# EasyEDA schematic SCH_LIGA2026_2026-04-17.json
TITLE: LIGA2026; REV: 1.0; Date: 2026-03-22; Sheet: 1/1; Drawn By: AIX; Company: AIX
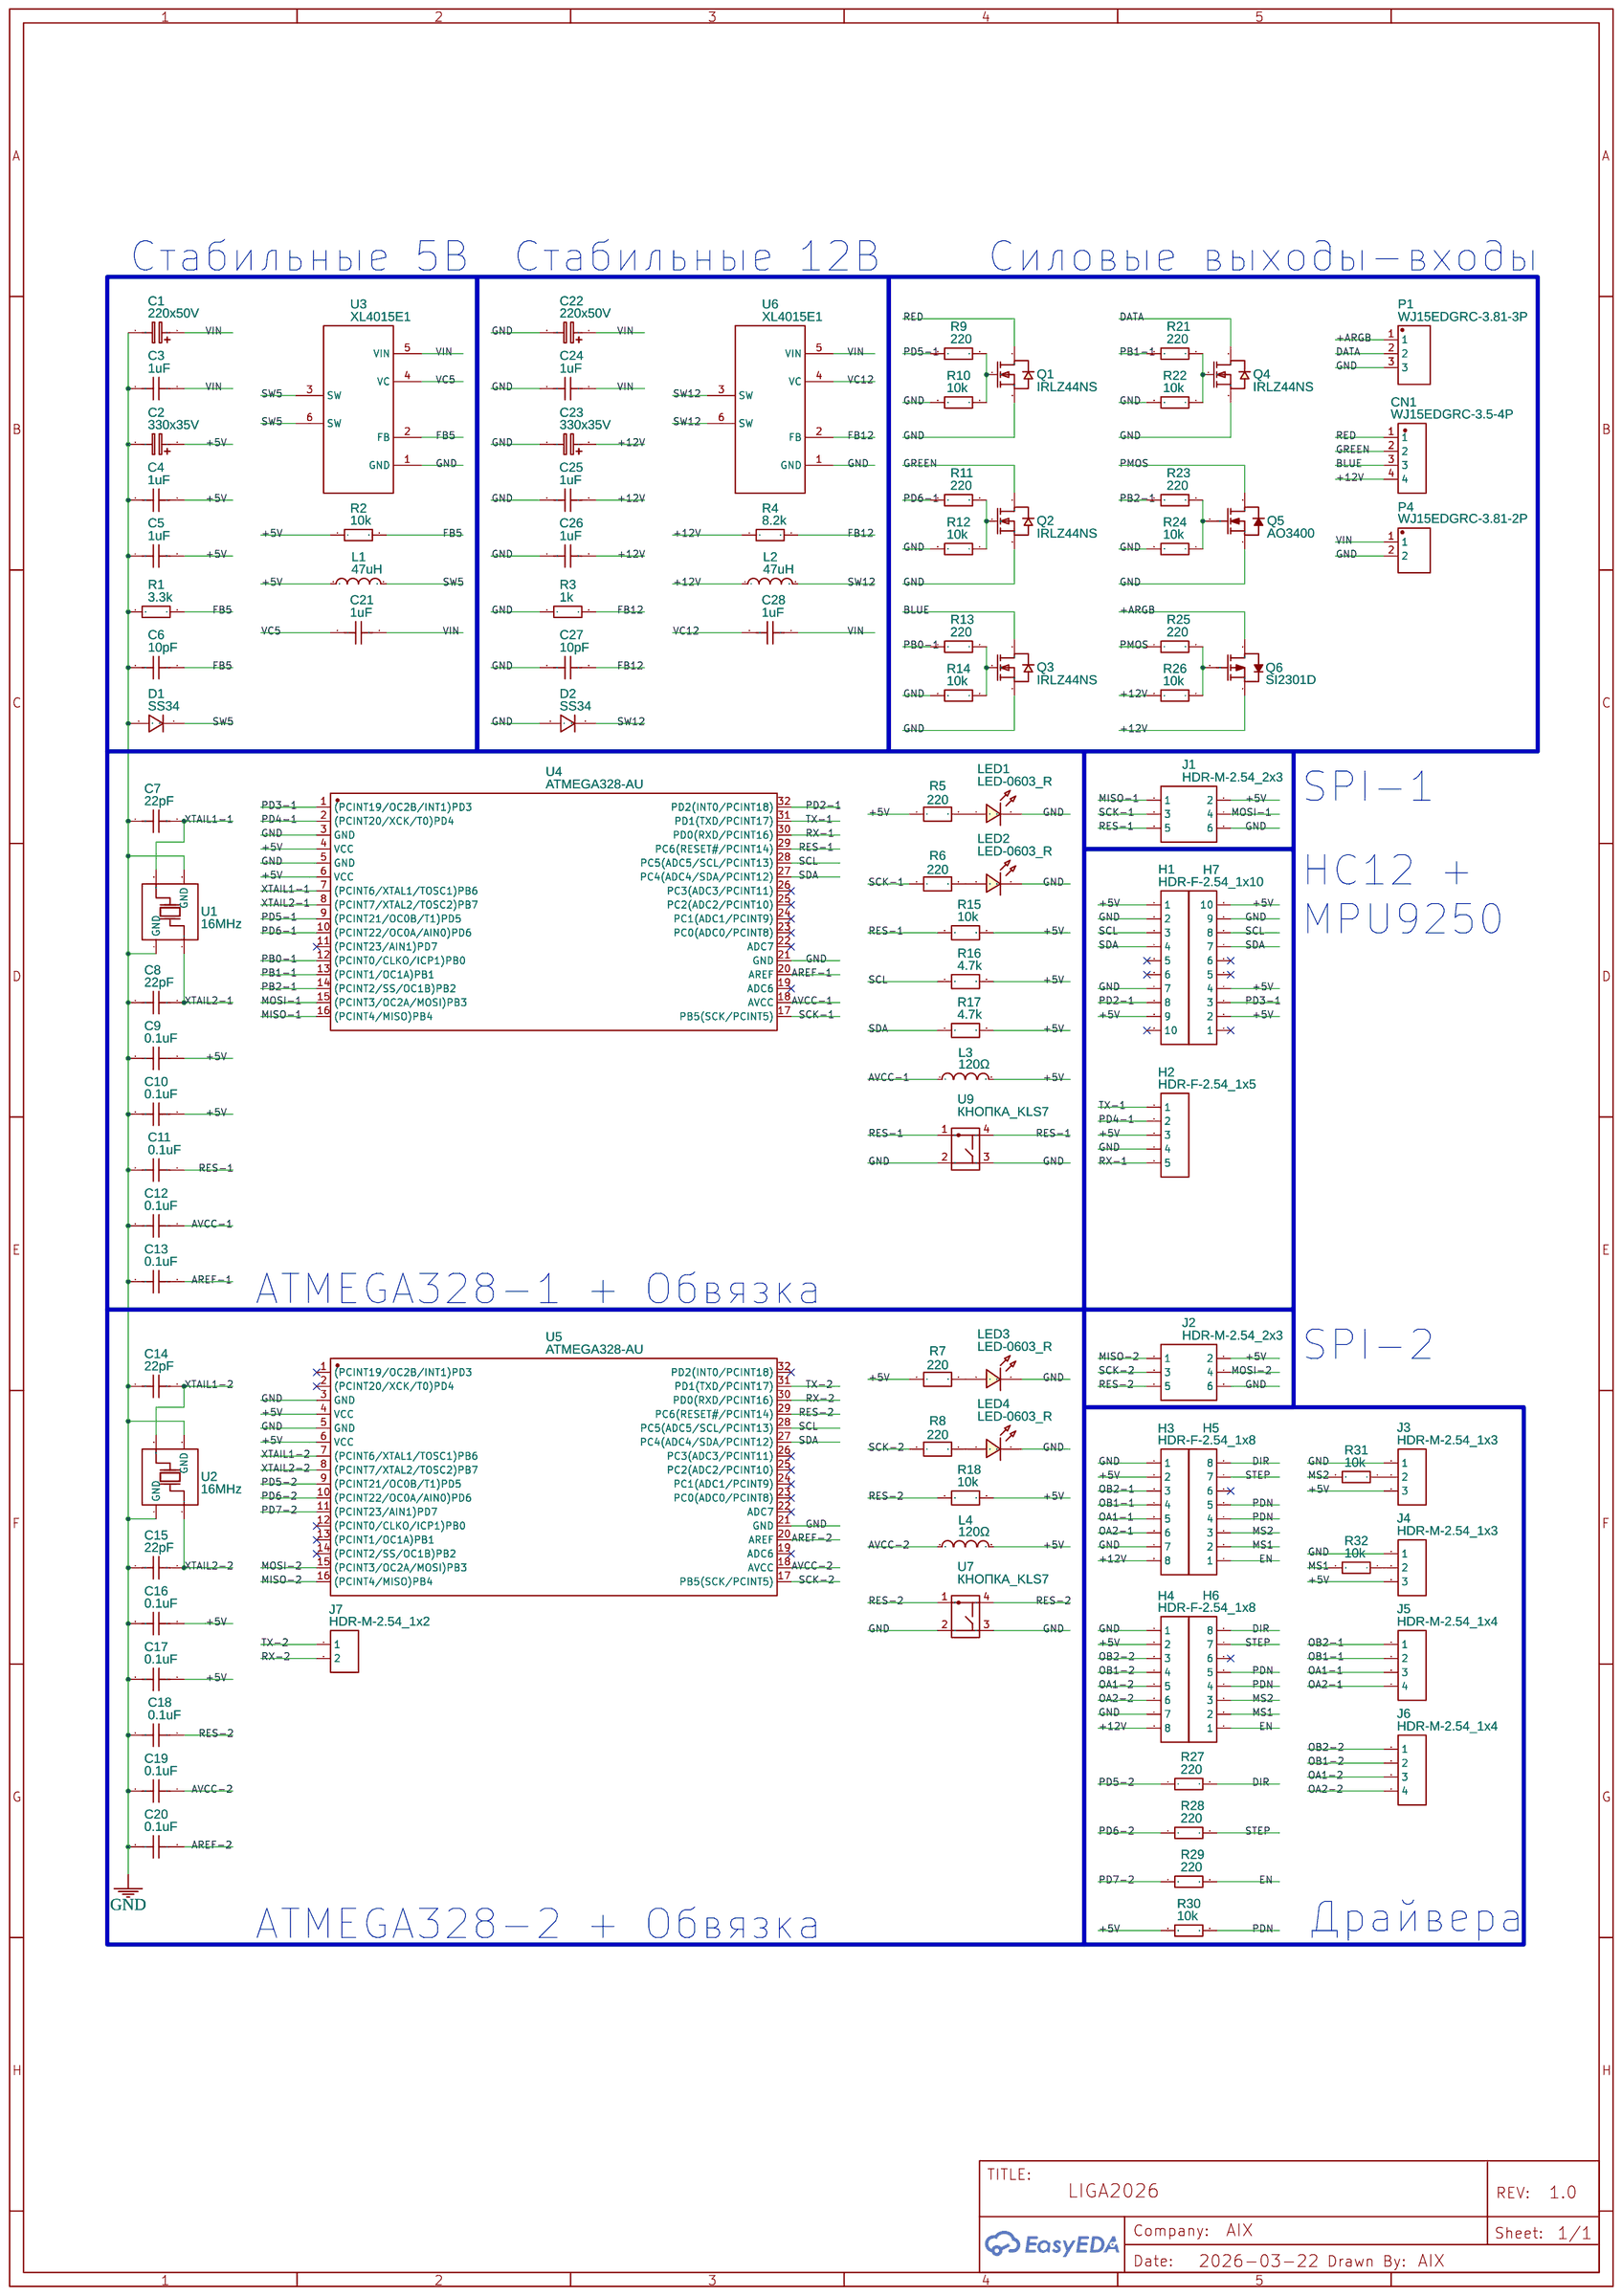
[diagram p0: schematic sheet]

## Parts
C1  220x50V  [ECAP-SMD-10X10.5 111]
C2  330x35V  [ECAP-SMD-10X10.5 111]
C3  1uF  [C0805]
C4  1uF  [C0805]
C5  1uF  [C0805]
C6  10pF  [C0603]
C7  22pF  [C0603]
C8  22pF  [C0603]
C9  0.1uF  [C0603]
C10  0.1uF  [C0603]
C11  0.1uF  [C0603]
C12  0.1uF  [C0603]
C13  0.1uF  [C0603]
C14  22pF  [C0603]
C15  22pF  [C0603]
C16  0.1uF  [C0603]
C17  0.1uF  [C0603]
C18  0.1uF  [C0603]
C19  0.1uF  [C0603]
C20  0.1uF  [C0603]
C21  1uF  [C0805]
C22  220x50V  [ECAP-SMD-10X10.5 111]
C23  330x35V  [ECAP-SMD-10X10.5 111]
C24  1uF  [C0805]
C25  1uF  [C0805]
C26  1uF  [C0805]
C27  10pF  [C0603]
C28  1uF  [C0805]
CN1  WJ15EDGRC-3.5-4P  [CONN-TH_4P-P3.50_WJ15EDGRC-3.5]
D1  SS34  [SS34_DO-214AC]
D2  SS34  [SS34_DO-214AC]
H1  HDR-F-2.54_1x10  [HDR-F-2.54_1X10]
H2  HDR-F-2.54_1x5  [HDR-F-2.54_1X5]
H3  HDR-F-2.54_1x8  [HDR-F-2.54_1X8]
H4  HDR-F-2.54_1x8  [HDR-F-2.54_1X8]
H5  HDR-F-2.54_1x8  [HDR-F-2.54_1X8]
H6  HDR-F-2.54_1x8  [HDR-F-2.54_1X8]
H7  HDR-F-2.54_1x10  [HDR-F-2.54_1X10]
J1  HDR-M-2.54_2x3  [HDR-M-2.54_2X3]
J2  HDR-M-2.54_2x3  [HDR-M-2.54_2X3]
J3  HDR-M-2.54_1x3  [HDR-M-2.54_1X3]
J4  HDR-M-2.54_1x3  [HDR-M-2.54_1X3]
J5  HDR-M-2.54_1x4  [HDR-M-2.54_1X4]
J6  HDR-M-2.54_1x4  [HDR-M-2.54_1X4]
J7  HDR-M-2.54_1x2  [HDR-M-2.54_1X2]
L1  47uH  [IND-SMD_L12.3-W12.3]
L2  47uH  [IND-SMD_L12.3-W12.3]
L3  120Ω  [L0805]
L4  120Ω  [L0805]
LED1  LED-0603_R  [LED0603_RED]
LED2  LED-0603_R  [LED0603_RED]
LED3  LED-0603_R  [LED0603_RED]
LED4  LED-0603_R  [LED0603_RED]
P1  WJ15EDGRC-3.81-3P  [CONN-TH_3P-P3.81_WJ15EDGRC-3.81-3P]
P4  WJ15EDGRC-3.81-2P  [CONN-TH_2P-P3.81_WJ15EDGRC-3.81-2P]
Q1  IRLZ44NS  [TO-263-2_L10.1-W9.1-P5.08-LS15.2-BR]
Q2  IRLZ44NS  [TO-263-2_L10.1-W9.1-P5.08-LS15.2-BR]
Q3  IRLZ44NS  [TO-263-2_L10.1-W9.1-P5.08-LS15.2-BR]
Q4  IRLZ44NS  [TO-263-2_L10.1-W9.1-P5.08-LS15.2-BR]
Q5  AO3400  [SOT-23-3_L2.9-W1.3-P1.90-LS2.4-BR]
Q6  SI2301D  [SOT-23-3_L2.9-W1.3-P1.90-LS2.4-BR]
R1  3.3k  [R0805]
R2  10k  [R0805]
R3  1k  [R0805]
R4  8.2k  [R0805]
R5  220  [R0603]
R6  220  [R0603]
R7  220  [R0603]
R8  220  [R0603]
R9  220  [R0805]
R10  10k  [R0805]
R11  220  [R0805]
R12  10k  [R0805]
R13  220  [R0805]
R14  10k  [R0805]
R15  10k  [R0603]
R16  4.7k  [R0603]
R17  4.7k  [R0603]
R18  10k  [R0603]
R21  220  [R0805]
R22  10k  [R0805]
R23  220  [R0805]
R24  10k  [R0805]
R25  220  [R0805]
R26  10k  [R0805]
R27  220  [R0805]
R28  220  [R0805]
R29  220  [R0805]
R30  10k  [R0805]
R31  10k  [R0805]
R32  10k  [R0805]
U1  16MHz  [CRYSTAL-SMD_4P-L2.5-W2.0-BL-2]
U2  16MHz  [CRYSTAL-SMD_4P-L2.5-W2.0-BL-2]
U3  XL4015E1  [TO-263-5_L10.2-W8.9-P1.70-TL]
U4  ATMEGA328-AU  [TQFP-32_L7.0-W7.0-P0.80-LS9.0-BL]
U5  ATMEGA328-AU  [TQFP-32_L7.0-W7.0-P0.80-LS9.0-BL]
U6  XL4015E1  [TO-263-5_L10.2-W8.9-P1.70-TL]
U7  КНОПКА_KLS7  [КНОПКА_KLS7-TS4407-1.5-180]
U9  КНОПКА_KLS7  [КНОПКА_KLS7-TS4407-1.5-180]

## Library data of the parts
C1 C2 C22 C23 = ECAP_SMD_10X10.5: Manufacturer Part: 330uF 35V (ECAP); Contributor: Onward
C3-C5 C21 C24-C26 C28 = 0805_C9900012713: Contributor: LCSC; Supplier: LCSC; Supplier Part: C9900012713; Manufacturer: null; Manufacturer Part: 0805; JLCPCB Part Class: Extended Part
C6 C27 = CSA0603C0G100J500JT: Supplier: LCSC; Supplier Part: C18220904; Manufacturer: HRE(芯声); Contributor: lcsc; JLCPCB Part Class: Extended Part
C7-C20 = C_0603_US: Contributor: LCEDA_Lib
CN1 = WJ15EDGRC-3.5-4P: Supplier: LCSC; Supplier Part: C5241865; Manufacturer: KANGNEX(康奈克斯电气); JLCPCB Part Class: Extended Part; Contributor: lcsc
D1 D2 = 1N4007W: Supplier: LCSC; Supplier Part: C328592; Manufacturer: BLUE ROCKET; Contributor: thanhtradt12; Package Display: No
H1 H7 = HDR-F-2.54_1x10: Supplier Part: C35445; Supplier: LCSC; Contributor: LCEDA_Lib
H2 = HDR-F-2.54_1x5: Supplier Part: C50950; Supplier: LCSC; Contributor: LCEDA_Lib
H3-H6 = HDR-F-2.54_1x8: Supplier Part: C225505; Supplier: LCSC; Contributor: LCEDA_Lib
J1 J2 = HDR-M-2.54_2x3: Supplier Part: C65114; Supplier: LCSC; Contributor: LCEDA_Lib
J3 J4 = HDR-M-2.54_1x3: Supplier Part: C180248; Supplier: LCSC; Contributor: LCEDA_Lib
J5 J6 = HDR-M-2.54_1x4: Supplier Part: C124378; Supplier: LCSC; Contributor: LCEDA_Lib
J7 = HDR-M-2.54_1x2: Supplier Part: C124375; Supplier: LCSC; Contributor: LCEDA_Lib
L1 L2 = MDE1040-2R2M: Supplier: LCSC; Supplier Part: C842880; Manufacturer: KOHERelec(科或); JLCPCB Part Class: Extended Part; Contributor: lcsc
L3 L4 = BLM21PG121SN1D: Supplier: LCSC; Manufacturer: muRata(村田); Supplier Part: C79382; JLCPCB Part Class: Extended Part
LED1-LED4 = LED-0603_R: Manufacturer: EVERLIGHT(台湾亿光); Manufacturer Part: 19-217/R6C-AL1M2VY/3T; Supplier Part: C72044; Supplier: LCSC; Contributor: LCEDA_01
P1 = WJ15EDGRC-3.81-3P: Supplier: LCSC; Manufacturer: KANGNEX(康奈克斯电气); Manufacturer Part: WJ15EDGRC-3.81-03P-14-00A; Supplier Part: C8406; JLCPCB Part Class: Extended Part
P4 = WJ15EDGRC-3.81-2P: Supplier: LCSC; Manufacturer: KANGNEX(康奈克斯电气); Manufacturer Part: WJ15EDGRC-3.81-02P-14-00A; Supplier Part: C8387; JLCPCB Part Class: Extended Part
Q1-Q4 = IRLZ44NSTRL(UMW): Supplier: LCSC; Supplier Part: C42370422; Manufacturer: UMW(友台半导体); Contributor: lcsc; JLCPCB Part Class: Extended Part
Q5 = AO3400A_C42419946: Supplier: LCSC; Supplier Part: C42419946; Manufacturer: ChipNobo(无边界); Manufacturer Part: AO3400A; Contributor: lcsc
Q6 = SI2301DS-ES: Contributor: lcsc; Supplier: LCSC; Supplier Part: C5224173; Manufacturer: ElecSuper(静芯); JLCPCB Part Class: Extended Part
R1-R4 R9-R14 R21-R32 = 0805_C9900012714: Contributor: LCSC; Supplier: LCSC; Supplier Part: C9900012714; Manufacturer: null; Manufacturer Part: 0805; JLCPCB Part Class: Extended Part
R5-R8 R15-R18 = R_0603_EU: Contributor: LCEDA_Lib
U1 U2 = NX2520SA-16MHZ-EXS00A-CS05116: Contributor: lcsc; Supplier: LCSC; Supplier Part: C1985881; Manufacturer: NDK; JLCPCB Part Class: Extended Part
U3 U6 = XL4015E1: Supplier: LCSC; Manufacturer: XLSEMI(芯龙); Supplier Part: C51661; JLCPCB Part Class: Extended Part
U4 U5 = ATMEGA328-AU: Contributor: LCSC; Supplier: LCSC; Supplier Part: C618731; Manufacturer: MICROCHIP(美国微芯); JLCPCB Part Class: Extended Part
U7 U9 = КНОПКА_KLS7-TS4407-1.5-180: Contributor: vlb.up4000

## Nets
+5V: C2.1 C4.1 C5.2 C9.1 C10.1 C16.1 C17.1 H1.1 H1.9 H2.3 H3.2 H4.2 H7.2 H7.4 H7.10 J1.2 J2.2 J3.3 J4.3 L1.1 L3.2 L4.2 R2.1 R5.1 R7.1 R15.2 R16.2 R17.2 R18.2 R30.2 U4.4(VCC) U4.6(VCC) U5.4(VCC) U5.6(VCC)
+12V: C23.1 C25.1 C26.2 CN1.4 H3.8 H4.8 L2.1 Q6.2(S) R4.1 R26.2
AVCC-1: C12.1 L3.1 U4.18(AVCC)
AVCC-2: C19.1 L4.1 U5.18(AVCC)
GND: C1.2 C2.2 C3.2 C4.2 C5.1 C6.2 C7.1 C8.1 C9.2 C10.2 C11.2 C12.2 C13.2 C14.1 C15.1 C16.2 C17.2 C18.2 C19.2 C20.2 C22.2 C23.2 C24.2 C25.2 C26.1 C27.2 D1.1 D2.1 H1.2 H1.7 H2.4 H3.1 H3.7 H4.1 H4.7 H7.9 J1.6 J2.6 J3.1 J4.1 LED1.2 LED2.2 LED3.2 LED4.2 P1.3 P4.2 Q1.3(S) Q2.3(S) Q3.3(S) Q4.3(S) Q5.2(S) R1.1 R3.1 R10.2 R12.2 R14.2 R22.2 R24.2 U1.2(GND) U1.4(GND) U2.2(GND) U2.4(GND) U3.1(GND) U4.3(GND) U4.5(GND) U4.21(GND) U5.3(GND) U5.5(GND) U5.21(GND) U6.1(GND) U7.2 U7.3 U9.2 U9.3
VIN: C1.1 C3.1 C21.1 C22.1 C24.1 C28.1 P4.1 U3.5(VIN) U6.5(VIN)
+ARGB: P1.1 Q6.3(D)
AREF-1: C13.1 U4.20(AREF)
AREF-2: C20.1 U5.20(AREF)
BLUE: CN1.3 Q3.2(D)
DATA: P1.2 Q4.2(D)
DIR: H5.8 H6.8 R27.2
EN: H5.1 H6.1 R29.2
FB5: C6.1 R1.2 R2.2 U3.2(FB)
FB12: C27.1 R3.2 R4.2 U6.2(FB)
GREEN: CN1.2 Q2.2(D)
MISO-1: J1.1 U4.16((PCINT4/MISO)PB4)
MISO-2: J2.1 U5.16((PCINT4/MISO)PB4)
MOSI-1: J1.4 U4.15((PCINT3/OC2A/MOSI)PB3)
MOSI-2: J2.4 U5.15((PCINT3/OC2A/MOSI)PB3)
MS1: H5.2 H6.2 R32.2
MS2: H5.3 H6.3 R31.2
OA1-1: H3.5 J5.3
OA1-2: H4.5 J6.3
OA2-1: H3.6 J5.4
OA2-2: H4.6 J6.4
OB1-1: H3.4 J5.2
OB1-2: H4.4 J6.2
OB2-1: H3.3 J5.1
OB2-2: H4.3 J6.1
PB0-1: R13.1 U4.12((PCINT0/CLKO/ICP1)PB0)
PB1-1: R21.1 U4.13((PCINT1/OC1A)PB1)
PB2-1: R23.1 U4.14((PCINT2/SS/OC1B)PB2)
PD2-1: H1.8 U4.32(PD2(INT0/PCINT18))
PD3-1: H7.3 U4.1((PCINT19/OC2B/INT1)PD3)
PD4-1: H2.2 U4.2((PCINT20/XCK/T0)PD4)
PD5-1: R9.1 U4.9((PCINT21/OC0B/T1)PD5)
PD5-2: R27.1 U5.9((PCINT21/OC0B/T1)PD5)
PD6-1: R11.1 U4.10((PCINT22/OC0A/AIN0)PD6)
PD6-2: R28.1 U5.10((PCINT22/OC0A/AIN0)PD6)
PD7-2: R29.1 U5.11((PCINT23/AIN1)PD7)
PDN: H5.4 H5.5 H6.4 H6.5 R30.1
PMOS: Q5.3(D) R25.1
RED: CN1.1 Q1.2(D)
RES-1: C11.1 J1.5 R15.1 U4.29(PC6(RESET#/PCINT14)) U9.1 U9.4
RES-2: C18.1 J2.5 R18.1 U5.29(PC6(RESET#/PCINT14)) U7.1 U7.4
RX-1: H2.5 U4.30(PD0(RXD/PCINT16))
RX-2: J7.2 U5.30(PD0(RXD/PCINT16))
SCK-1: J1.3 R6.1 U4.17(PB5(SCK/PCINT5))
SCK-2: J2.3 R8.1 U5.17(PB5(SCK/PCINT5))
SCL: H1.3 H7.8 R16.1 U4.28(PC5(ADC5/SCL/PCINT13)) U5.28(PC5(ADC5/SCL/PCINT13))
SDA: H1.4 H7.7 R17.1 U4.27(PC4(ADC4/SDA/PCINT12)) U5.27(PC4(ADC4/SDA/PCINT12))
STEP: H5.7 H6.7 R28.2
SW5: D1.2 L1.2 U3.3(SW) U3.6(SW)
SW12: D2.2 L2.2 U6.3(SW) U6.6(SW)
TX-1: H2.1 U4.31(PD1(TXD/PCINT17))
TX-2: J7.1 U5.31(PD1(TXD/PCINT17))
VC5: C21.2 U3.4(VC)
VC12: C28.2 U6.4(VC)
XTAIL1-1: C7.2 U1.3(OSC2) U4.7((PCINT6/XTAL1/TOSC1)PB6)
XTAIL1-2: C14.2 U2.3(OSC2) U5.7((PCINT6/XTAL1/TOSC1)PB6)
XTAIL2-1: C8.2 U1.1(OSC1) U4.8((PCINT7/XTAL2/TOSC2)PB7)
XTAIL2-2: C15.2 U2.1(OSC1) U5.8((PCINT7/XTAL2/TOSC2)PB7)
Net-(J3-2): J3.2 R31.1
Net-(J4-2): J4.2 R32.1
Net-(LED1-1): LED1.1 R5.2
Net-(LED2-1): LED2.1 R6.2
Net-(LED3-1): LED3.1 R7.2
Net-(LED4-1): LED4.1 R8.2
Net-(Q1-1): Q1.1(G) R9.2 R10.1
Net-(Q2-1): Q2.1(G) R11.2 R12.1
Net-(Q3-1): Q3.1(G) R13.2 R14.1
Net-(Q4-1): Q4.1(G) R21.2 R22.1
Net-(Q5-1): Q5.1(G) R23.2 R24.1
Net-(Q6-1): Q6.1(G) R25.2 R26.1

Not connected (* = marked no-connect by the designer): H1 5* 6* 10*; H5 6*; H6 6*; H7 1* 5* 6*; U4 11((PCINT23/AIN1)PD7)* 19(ADC6)* 22(ADC7)* 23(PC0(ADC0/PCINT8))* 24(PC1(ADC1/PCINT9))* 25(PC2(ADC2/PCINT10))* 26(PC3(ADC3/PCINT11))*; U5 1((PCINT19/OC2B/INT1)PD3)* 2((PCINT20/XCK/T0)PD4)* 12((PCINT0/CLKO/ICP1)PB0)* 13((PCINT1/OC1A)PB1)* 14((PCINT2/SS/OC1B)PB2)* 19(ADC6)* 22(ADC7)* 23(PC0(ADC0/PCINT8))* 24(PC1(ADC1/PCINT9))* 25(PC2(ADC2/PCINT10))* 26(PC3(ADC3/PCINT11))* 32(PD2(INT0/PCINT18))*

## Notes on the sheet
- Стабильные 5В
- Стабильные 12В
- Силовые выходы-входы
- SPI-1
- HC12 +
- MPU9250
- ATMEGA328-1 + Обвязка
- SPI-2
- ATMEGA328-2 + Обвязка
- Драйвера
